# Altium schematic sheet Power.SchDoc
size A
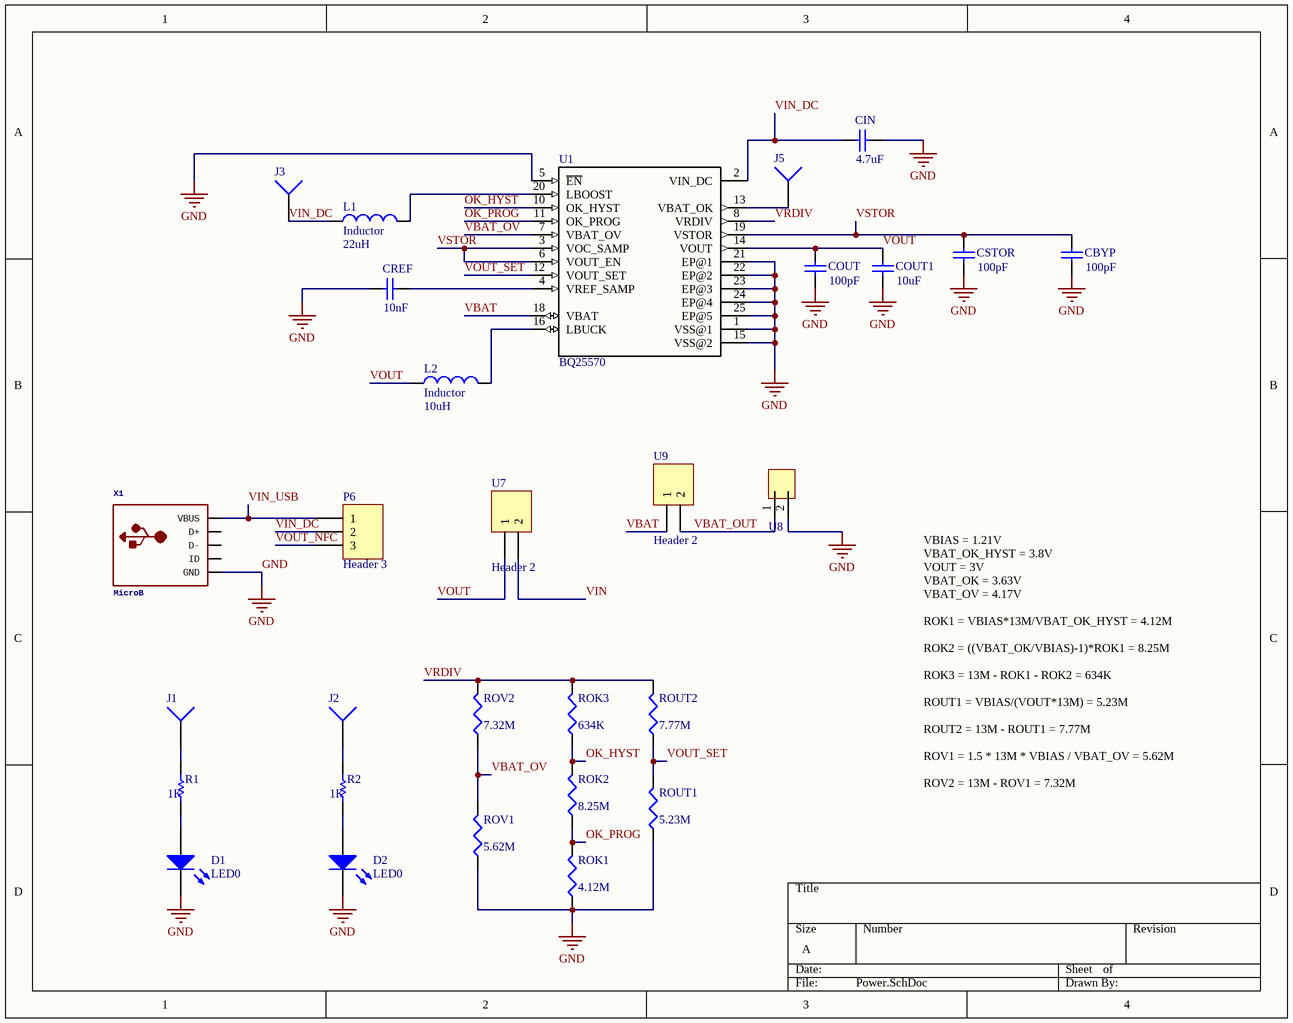
[diagram p0: Power.SchDoc]

## Parts
CBYP  value 100pF  [C1206]  (hidden comment: Cap Semi)
CIN  value 4.7uF  [C1206]  (hidden comment: Cap Semi)
COUT  value 100pF  [C1206]  (hidden comment: Cap Semi)
COUT1  value 10uF  [C1206]  (hidden comment: Cap Semi)
CREF  value 10nF  [C1206]  (hidden comment: Cap Semi)
CSTOR  value 100pF  [C1206]  (hidden comment: Cap Semi)
D1  LED0  [LED-0]
D2  LED0  [LED-0]
J1  Socket  [PIN1]  (value not drawn)
J2  Socket  [PIN1]  (value not drawn)
J3  Socket  [PIN1]  (value not drawn)
J5  Socket  [PIN1]  (value not drawn)
L1  Inductor  value 22uH  [0402-A]
L2  Inductor  value 10uH  [0402-A]
P6  Header 3  [HDR1X3]
R1  value 1K  [AXIAL-0.3]  (hidden comment: Res1)
R2  value 1K  [AXIAL-0.3]  (hidden comment: Res1)
ROK1  value 4.12M  [J1-0603]  (hidden comment: Res3)
ROK2  value 8.25M  [J1-0603]  (hidden comment: Res3)
ROK3  value 634K  [J1-0603]  (hidden comment: Res3)
ROUT1  value 5.23M  [J1-0603]  (hidden comment: Res3)
ROUT2  value 7.77M  [J1-0603]  (hidden comment: Res3)
ROV1  value 5.62M  [J1-0603]  (hidden comment: Res3)
ROV2  value 7.32M  [J1-0603]  (hidden comment: Res3)
U1  BQ25570  [QFN50P350X350X100-21N]
U7  Header 2  [HDR1X2]
U8  JST_Conn  [JST]  (value not drawn)
U9  Header 2  [HDR1X2]
X1  MicroB  [629105150921]

## Nets
GND: CBYP.1 CIN.2 COUT.1 COUT1.1 CREF.1 CSTOR.1 D1.2(K) D2.2(K) ROK1.1 ROUT1.1 ROV1.1 U1.1(VSS@1) U1.5(~{EN}) U1.15(VSS@2) U1.21(EP@1) U1.22(EP@2) U1.23(EP@3) U1.24(EP@4) U1.25(EP@5) U8.2 X1.5(GND)
OK_HYST: ROK2.2 ROK3.1 U1.10(OK_HYST)
OK_PROG: ROK1.2 ROK2.1 U1.11(OK_PROG)
VBAT: U1.18(VBAT) U9.1
VBAT_OUT: U8.1 U9.2
VBAT_OV: ROV1.2 ROV2.1 U1.7(VBAT_OV)
VIN: U7.2
VIN_DC: CIN.1 J3.1 L1.1 P6.2 U1.2(VIN_DC)
VIN_USB: P6.1 X1.1(VBUS)
VOUT: COUT.2 COUT1.2 L2.1 U1.14(VOUT) U7.1
VOUT_NFC: P6.3
VOUT_SET: ROUT1.2 ROUT2.1 U1.12(VOUT_SET)
VRDIV: ROK3.2 ROUT2.2 ROV2.2 U1.8(VRDIV)
VSTOR: CBYP.2 CSTOR.2 U1.3(VOC_SAMP) U1.6(VOUT_EN) U1.19(VSTOR)
NetCREF_2: CREF.2 U1.4(VREF_SAMP)
NetD1_1: D1.1(A) R1.1
NetD2_1: D2.1(A) R2.1
NetJ1_1: J1.1 R1.2
NetJ2_1: J2.1 R2.2
NetJ5_1: J5.1 U1.13(VBAT_OK)
NetL1_2: L1.2 U1.20(LBOOST)
NetL2_2: L2.2 U1.16(LBUCK)

Not connected (* = marked no-connect by the designer): X1 2(D+) 3(D-) 4(ID)

## Notes on the sheet
- VBIAS = 1.21V
  VBAT_OK_HYST = 3.8V
  VOUT = 3V
  VBAT_OK = 3.63V
  VBAT_OV = 4.17V
  ROK1 = VBIAS*13M/VBAT_OK_HYST = 4.12M
  ROK2 = ((VBAT_OK/VBIAS)-1)*ROK1 = 8.25M
  ROK3 = 13M - ROK1 - ROK2 = 634K
  ROUT1 = VBIAS/(VOUT*13M) = 5.23M
  ROUT2 = 13M - ROUT1 = 7.77M
  ROV1 = 1.5 * 13M * VBIAS / VBAT_OV = 5.62M
  ROV2 = 13M - ROV1 = 7.32M

## Library data of the parts
CBYP COUT CSTOR = Cap Semi: CAP CER 100PF 50V C0G/NPO 0603; Manufacturer: Yageo; Manufacturer Part Number: CC0603JRNPO9BN101; Digi-Key Part Number: 311-1069-1-ND
CIN = Cap Semi: CAP CER 4.7UF 10V X5R 0603; Manufacturer: Samsung Electro-Mechanics; Manufacturer Part Number: CL10A475MP5LNNC; Digi-Key Part Number: 1276-6684-1-ND
COUT1 = Cap Semi: CL10A106MQ8NNNC; Manufacturer: Samsung Electro-Mechanics; Digi-Key Part Number: 1276-1119-1-ND; Manufacturer Part Number: CL10A106MQ8NNNC
CREF = Cap Semi: CAP CER 10000PF 100V X7R 0603; Manufacturer: TDK Corporation; Manufacturer Part Number: C1608X7R2A103M080AA; Digi-Key Part Number: 445-1305-1-ND
D1 D2 = LED0: LED BLUE CLEAR CHIP SMD; Manufacturer: Kingbright; Manufacturer Part Number: APT1608QBC/D; Digi-Key Part Number: 754-1434-1-ND
L1 = Inductor: FIXED IND 22UH 510MA 450 MOHM; Manufacturer: Wurth Electronics Inc.; Manufacturer Part Number: 744031220; Digi-Key Part Number: 732-1012-1-ND
L2 = Inductor: FIXED IND 10UH 1A 460 MOHM SMD; Manufacturer: Murata Electronics North America; Manufacturer Part Number: 1239AS-H-100M=P2; Digi-Key Part Number: 490-10563-1-ND
P6 = Header 3: Header, 3-Pin; LatestRevisionDate: 17-Jul-2002; LatestRevisionNote: Re-released for DXP Platform.; Publisher: Altium Limited
R1 R2 = Res1: RES SMD 1K OHM 0.5% 1/16W 0603; Manufacturer: Susumu; Manufacturer Part Number: RR0816P-102-D; Digi-Key Part Number: RR08P1.0KDCT-ND
ROK1 = Res3: RES SMD 4.12M OHM 1% 1/10W 0603; Manufacturer Part Number: CRCW06034M12FKEA; Manufacturer: Vishay Dale; Digi-Key Part Number: 541-4.12MHCT-ND
ROK2 = Res3: RES SMD 8.25M OHM 1% 1/10W 0603; Manufacturer: Vishay Dale; Manufacturer Part Number: CRCW06038M25FKEA; Digi-Key Part Number: 541-8.25MHCT-ND
ROK3 = Res3: RES SMD 634K OHM 1% 1/10W 0603; Manufacturer: Yageo; Manufacturer Part Number: RC0603FR-07634KL; Digi-Key Part Number: 311-634KHRCT-ND
ROUT1 = Res3: RES SMD 5.23M OHM 1% 1/10W 0603; Manufacturer: Vishay Dale; Manufacturer Part Number: CRCW06035M23FKEA; Digi-Key Part Number: 541-5.23MHCT-ND
ROUT2 = Res3: RES SMD 7.68M OHM 1% 1/10W 0603; Manufacturer: Vishay Dale; Manufacturer Part Number: CRCW06037M68FKEA; Digi-Key Part Number: 541-7.68MHCT-ND
ROV1 = Res3: RES 5.62M OHM 1% 1/10W 0603; Manufacturer: Stackpole Electronics Inc.; Manufacturer Part Number: RMCF0603FT5M62; Digi-Key Part Number: RMCF0603FT5M62CT-ND
ROV2 = Res3: RES 7.32M OHM 1% 1/10W 0603; Manufacturer: Stackpole Electronics Inc.; Manufacturer Part Number: RMCF0603FT7M32; Digi-Key Part Number: RMCF0603FT7M32CT-ND
U1 = BQ25570RGRR: IC ENERGY HARV CTRLR BATT 20VQFN; Manufacturer: Texas Instruments; Digi-Key Part Number: 296-39934-1-ND; Manufacturer Part Number: BQ25570RGRR; DatasheetLink: http://www.ti.com/lit/ds/symlink/bq25570.pdf
U7 U9 = Header 2: Header, 2-Pin; LatestRevisionDate: 17-Jul-2002; LatestRevisionNote: Re-released for DXP Platform.; Publisher: Altium Limited
X1 = USBMICRO_20329: CONN RCPT STD MICRO USB TYPE B; Manufacturer: Amphenol FCI; ManufacturerPartNo: 10103594-0001LF; ComponentLink1Description: Datasheet; ComponentLink1URL: http://cdn.amphenol-icc.com/media/wysiwyg/files/documentation/datasheet/inputoutput/io_usb_micro.pdf; Supplier: Digi-Key; SupplierPartNo: 609-4050-1-ND; SupplierLink1URL: https://www.digikey.com/product-detail/en/amphenol-fci/10103594-0001LF/609-4050-1-ND/2350357
J1-J3 J5 = Socket: LatestRevisionDate: 17-Jul-2002; LatestRevisionNote: Re-released for DXP Platform.; Publisher: Altium Limited